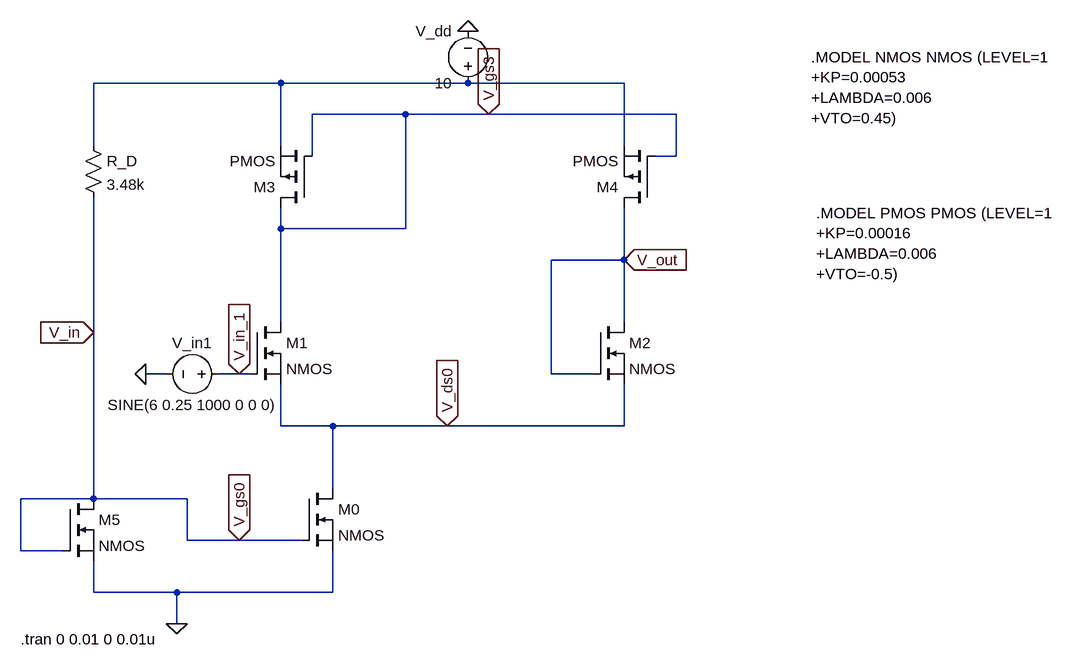
[diagram p0: schematic Q3_a.asc]
Q3_a.asc, the LTspice schematic file:
Version 4
SHEET 1 1368 920
WIRE 176 48 -112 48
WIRE 464 48 176 48
WIRE 704 48 464 48
WIRE 368 96 224 96
WIRE 496 96 368 96
WIRE 784 96 496 96
WIRE -112 144 -112 48
WIRE 176 144 176 48
WIRE 704 144 704 48
WIRE 224 160 224 96
WIRE 784 160 784 96
WIRE 784 160 752 160
WIRE 176 272 176 240
WIRE 368 272 368 96
WIRE 368 272 176 272
WIRE 704 320 704 240
WIRE 704 320 592 320
WIRE 176 416 176 272
WIRE 704 416 704 320
WIRE -112 432 -112 224
WIRE 0 496 -32 496
WIRE 112 496 80 496
WIRE 128 496 112 496
WIRE 592 496 592 320
WIRE 656 496 592 496
WIRE 176 576 176 512
WIRE 256 576 176 576
WIRE 432 576 256 576
WIRE 704 576 704 512
WIRE 704 576 432 576
WIRE 256 672 256 576
WIRE -112 688 -112 432
WIRE -112 688 -224 688
WIRE 32 688 -112 688
WIRE 32 752 32 688
WIRE 112 752 32 752
WIRE 208 752 112 752
WIRE -224 768 -224 688
WIRE -160 768 -224 768
WIRE -112 832 -112 784
WIRE 16 832 -112 832
WIRE 256 832 256 768
WIRE 256 832 16 832
WIRE 16 880 16 832
FLAG 16 880 0
FLAG 464 -32 0
FLAG -32 496 0
FLAG 112 752 V_gs0
IOPIN 112 752 In
FLAG 432 576 V_ds0
IOPIN 432 576 In
FLAG 496 96 V_gs3
IOPIN 496 96 In
FLAG 704 320 V_out
IOPIN 704 320 In
FLAG 112 496 V_in_1
IOPIN 112 496 In
FLAG -112 432 V_in
IOPIN -112 432 In
SYMBOL voltage 464 64 R180
WINDOW 0 24 96 Left 2
WINDOW 3 24 16 Left 2
WINDOW 123 0 0 Left 0
WINDOW 39 0 0 Left 0
SYMATTR InstName V_dd
SYMATTR Value 10
SYMBOL nmos 208 672 R0
SYMATTR InstName M0
SYMBOL nmos -160 688 R0
SYMATTR InstName M5
SYMBOL nmos 128 416 R0
SYMATTR InstName M1
SYMBOL nmos 656 416 R0
SYMATTR InstName M2
SYMBOL res -128 128 R0
SYMATTR InstName R_D
SYMATTR Value 3.48k
SYMBOL voltage 96 496 R90
WINDOW 0 -32 56 VBottom 2
WINDOW 3 32 56 VTop 2
SYMATTR InstName V_in1
SYMATTR Value SINE(6 0.25 1000 0 0 0)
SYMBOL pmos 224 240 R180
SYMATTR InstName M3
SYMBOL pmos 752 240 R180
SYMATTR InstName M4
TEXT 992 8 Left 2 !.MODEL NMOS NMOS (LEVEL=1 \n+KP=0.00053\n+LAMBDA=0.006\n+VTO=0.45)
TEXT 1000 248 Left 2 !.MODEL PMOS PMOS (LEVEL=1 \n+KP=0.00016\n+LAMBDA=0.006\n+VTO=-0.5)
TEXT -224 904 Left 2 !.tran 0 0.01 0 0.01u

The netlist it stands for:
* Q3_a.asc
V_dd N001 0 10
M0 V_ds0 V_in 0 0 NMOS
M5 V_in V_in 0 0 NMOS
M1 V_gs3 V_in_1 V_ds0 V_ds0 NMOS
M2 V_out V_out V_ds0 V_ds0 NMOS
R_D N001 V_in 3.48k
V_in1 V_in_1 0 SINE(6 0.25 1000 0 0 0)
M3 V_gs3 V_gs3 N001 N001 PMOS
M4 V_out V_gs3 N001 N001 PMOS
.model NMOS NMOS
.model PMOS PMOS
.lib standard.mos
.MODEL NMOS NMOS (LEVEL=1
+KP=0.00053
+LAMBDA=0.006
+VTO=0.45)
.MODEL PMOS PMOS (LEVEL=1
+KP=0.00016
+LAMBDA=0.006
+VTO=-0.5)
.tran 0 0.01 0 0.01u
.backanno
.end